# EAGLE schematic reciever_board (EAGLE 9.6.2)
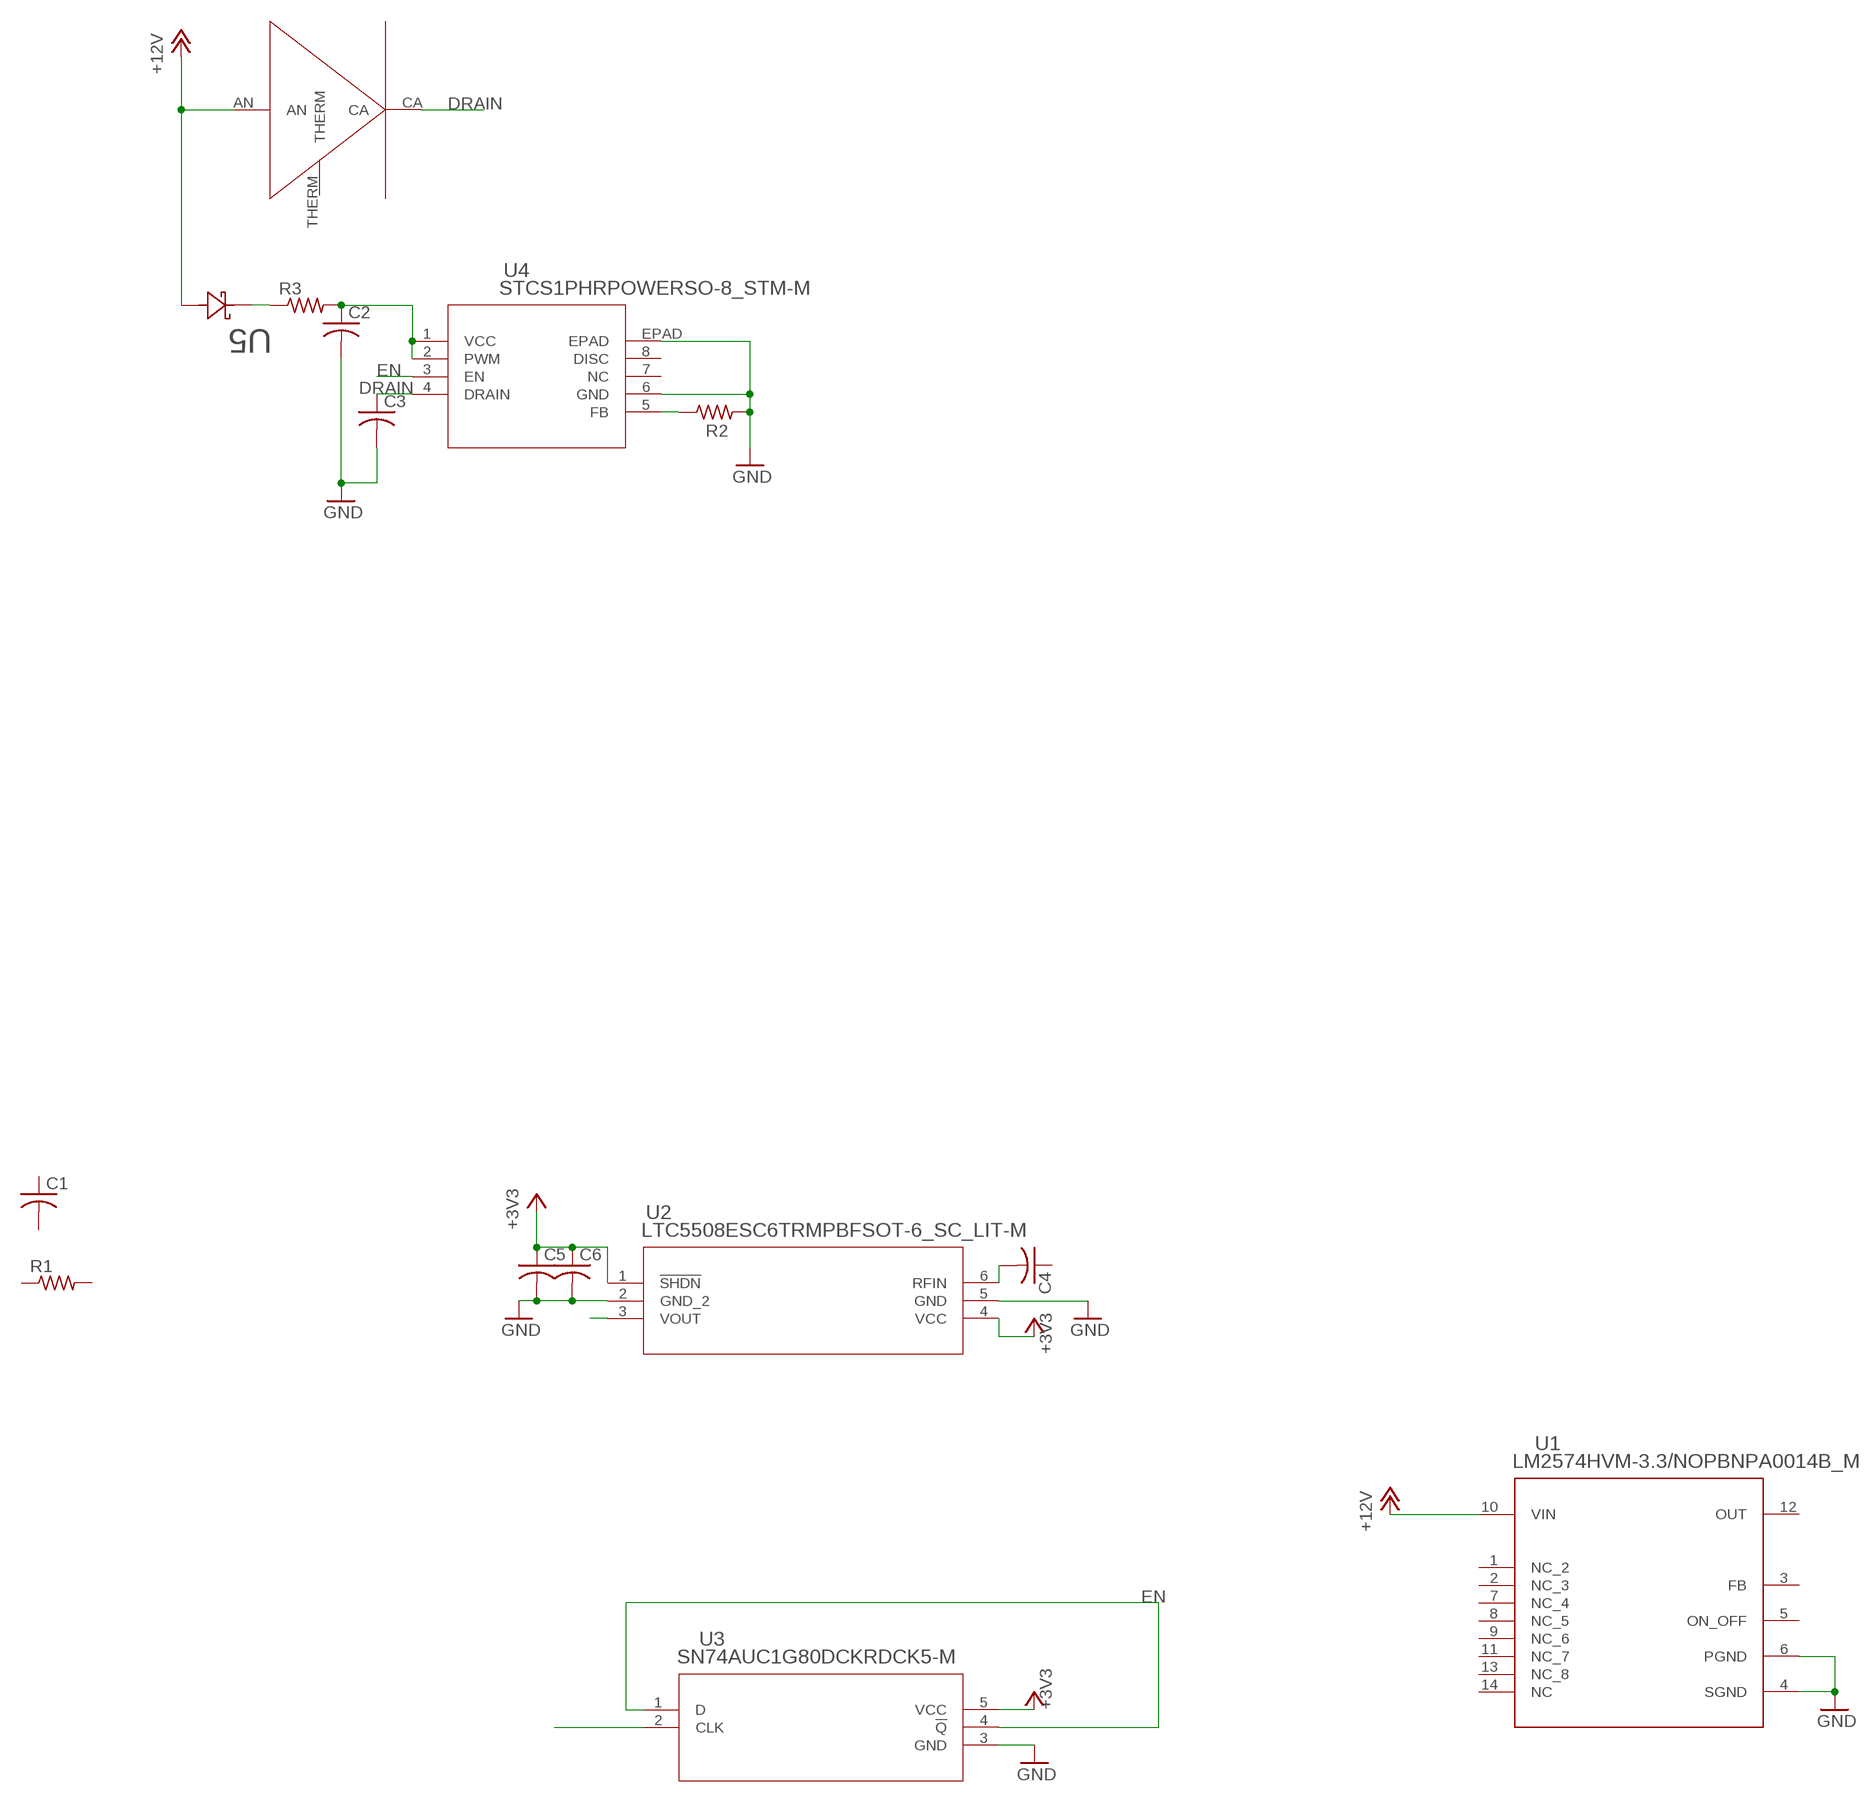
[diagram p0: schematic, sheet 1]

## Parts
C1  C-USC0603  [C0603]
C2  C-USC0603  [C0603]
C3  C-USC0603  [C0603]
C4  C-USC0603  [C0603]
C5  C-USC0603  [C0603]
C6  C-USC0603  [C0603]
R1  R-US_R0603  [R0603]
R2  R-US_R0603  [R0603]
R3  R-US_R0603  [R0603]
U1  LM2574HVM-3.3/NOPBNPA0014B_M  [NPA0014B_M]
U2  LTC5508ESC6TRMPBFSOT-6_SC_LIT-M  [SOT-6_SC_LIT-M]
U3  SN74AUC1G80DCKRDCK5-M  [DCK5-M]
U4  STCS1PHRPOWERSO-8_STM-M  [POWERSO-8_STM-M]
U5  CDBW46-GCDBW-M  [CDBW-M]
U$1  MKRAWT-02-0000-0D00J2051  [MKRAWT-02-0000-0D00J2051]

## Nets
+3V3: C5.1 C6.1 U2.1(!SHDN) U2.4(VCC) U3.5(VCC)
+12V: U1.10(VIN) U5.2 U$1.AN
DRAIN: C3.1 U4.4(DRAIN) U$1.CA
EN: U3.1(D) U3.4(!Q) U4.3(EN)
GND: C2.2 C3.2 C5.2 C6.2 R2.2 U1.4(SGND) U1.6(PGND) U2.2(GND_2) U2.5(GND) U3.3(GND) U4.6(GND) U4.EPAD
N$2: C4.2 U2.6(RFIN)
N$4: R2.1 U4.5(FB)
N$5: R3.1 U5.1
N$6: U3.2(CLK)
N$7: C2.1 R3.2 U4.1(VCC) U4.2(PWM)
TOGGLE: U2.3(VOUT)
Unconnected: C1.1 C1.2 C4.1 R1.1 R1.2 U1.1(NC_2) U1.2(NC_3) U1.3(FB) U1.5(ON_OFF) U1.7(NC_4) U1.8(NC_5) U1.9(NC_6) U1.11(NC_7) U1.13(NC_8) U1.14(NC) U4.7(NC) U4.8(DISC) U$1.THERM

## Power pins joined to a net without a drawn wire
OUT: U1.12(OUT)

## Library data of the parts
C1-C6 = rcl:C-US: CAPACITOR, American symbol; SPICEPREFIX: C
R1-R3 = rcl:R-US_: RESISTOR, American symbol; SPICEPREFIX: R
U1 = boat_light:LM2574HVM-3.3/NOPB; COPYRIGHT: Copyright (C) 2022 Ultra Librarian. All rights reserved.; DIGI-KEY_PART_NUMBER_1: LM2574HVM-3.3/NOPB-ND; DIGI-KEY_PART_NUMBER_2: 2156-LM2574HVM-3.3/NOPB-ND; MANUFACTURER_PART_NUMBER: LM2574HVM-3.3/NOPB; MFR_NAME: Texas Instruments; REFDES: RefDes; TYPE: TYPE
U2 = boat_light:LTC5508ESC6TRMPBF; COPYRIGHT: Copyright (C) 2022 Ultra Librarian. All rights reserved.; DIGI-KEY_PART_NUMBER_1: LTC5508ESC6#TRMPBFCT-ND; DIGI-KEY_PART_NUMBER_2: LTC5508ESC6#TRMPBFDKR-ND; DIGI-KEY_PART_NUMBER_3: LTC5508ESC6#TRMPBFTR-ND; MANUFACTURER_PART_NUMBER: LTC5508ESC6#TRMPBF; MFR_NAME: Analog Devices / Linear Technology
U3 = boat_light:SN74AUC1G80DCKR; COPYRIGHT: Copyright (C) 2022 Ultra Librarian. All rights reserved.; DIGI-KEY_PART_NUMBER_1: 296-14310-1-ND; DIGI-KEY_PART_NUMBER_2: 296-14310-2-ND; DIGI-KEY_PART_NUMBER_3: 296-14310-6-ND; DIGI-KEY_PART_NUMBER_4: 2156-SN74AUC1G80DCKR-ND; MANUFACTURER_PART_NUMBER: SN74AUC1G80DCKR; MFR_NAME: Texas Instruments
U4 = boat_light:STCS1PHR; COPYRIGHT: Copyright (C) 2022 Ultra Librarian. All rights reserved.; DIGI-KEY_PART_NUMBER_1: 497-5961-2-ND; DIGI-KEY_PART_NUMBER_2: 497-5961-1-ND; DIGI-KEY_PART_NUMBER_3: 497-5961-6-ND; DIGI-KEY_PART_NUMBER_4: 1026-STCS1PHR-CHP; MANUFACTURER_PART_NUMBER: STCS1PHR; MFR_NAME: STMicroelectronics
U5 = boat_light:CDBW46-G; COPYRIGHT: Copyright (C) 2022 Ultra Librarian. All rights reserved.; DIGI-KEY_PART_NUMBER_1: 641-1964-1-ND; DIGI-KEY_PART_NUMBER_2: 641-1964-2-ND; DIGI-KEY_PART_NUMBER_3: 641-1964-6-ND; DIGI-KEY_PART_NUMBER_4: CDBW46-G-ND; MANUFACTURER_PART_NUMBER: CDBW46-G; MFR_NAME: Comchip
U$1 = boat_light:MKRAWT-02-0000-0D00J2051